# EAGLE design working (EAGLE 6.5.0)
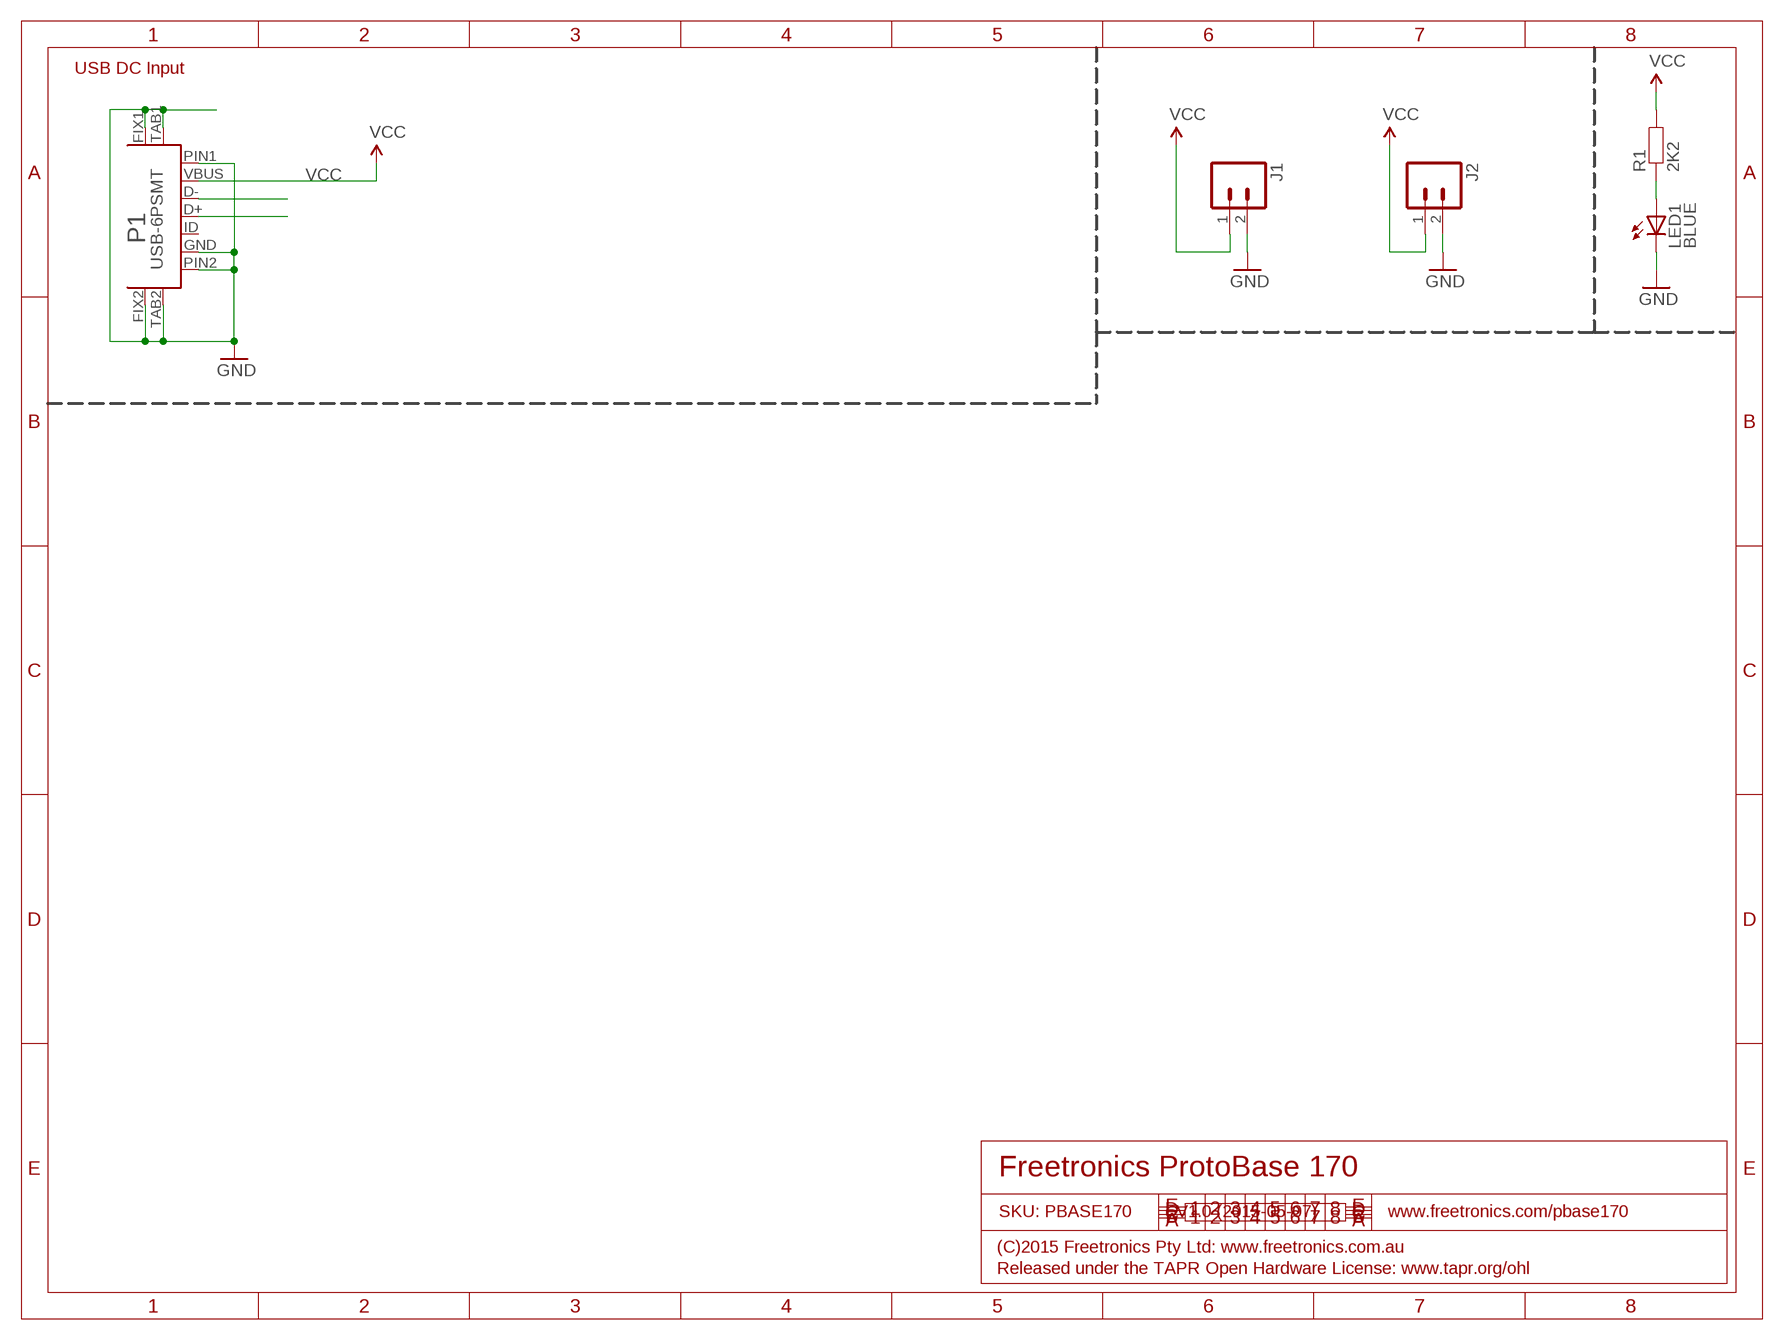
[diagram p0: schematic, sheet 1]

## Parts
J1  M02PTH  [1X02]
J2  M02PTH  [1X02]
LED1  BLUE  LED0603  [LED-0603]
P1  USB-6PSMT  [USB-MICROB-MB05PMXX]
R1  2K2  RESISTOR0603  [0603]

## Nets
GND: J1.2 J2.2 LED1.C P1.FIX1 P1.FIX2 P1.GND P1.PIN1 P1.PIN2 P1.TAB1 P1.TAB2
N$1: LED1.A R1.1
N$16: P1.D+
N$17: P1.D-
VCC: J1.1 J2.1 P1.VBUS R1.2
Unconnected: P1.ID

## Notes on the sheet
- USB DC Input
- Freetronics ProtoBase 170
- SKU: PBASE170 | V1.0 (2015-05-07) | www.freetronics.com/pbase170
- (C)2015 Freetronics Pty Ltd: www.freetronics.com.au
- Released under the TAPR Open Hardware License: www.tapr.org/ohl

## Library data of the parts
J1 J2 = freetronics-original:M02: Header 2 Standard 2-pin 0.1" header. Use with straight break away headers (SKU : PRT-00116), right angle break away headers (PRT-00553), swiss pins (PRT-00743), machine pins (PRT-00117), and female headers (PRT-00115). Molex polarized connector foot print use with SKU : PRT-08233 with associated crimp pins and housings.
LED1 = freetronics-jon:LED: LEDs Standard schematic elements and footprints for 5mm, 3mm, 1206, and 0603 sized LEDs. 5mm - Spark Fun Electronics SKU : COM-00529 (and others)
P1 = freetronics-jon:USB-6P
R1 = freetronics-jon:RESISTOR: Resistor Basic schematic elements and footprints for 0603, 1206, and PTH 1/10th watt (small) resistors.

## Net classes
0 default: width 0.152 mm, drill 0.241 mm, clearance 0.152 mm

## Board
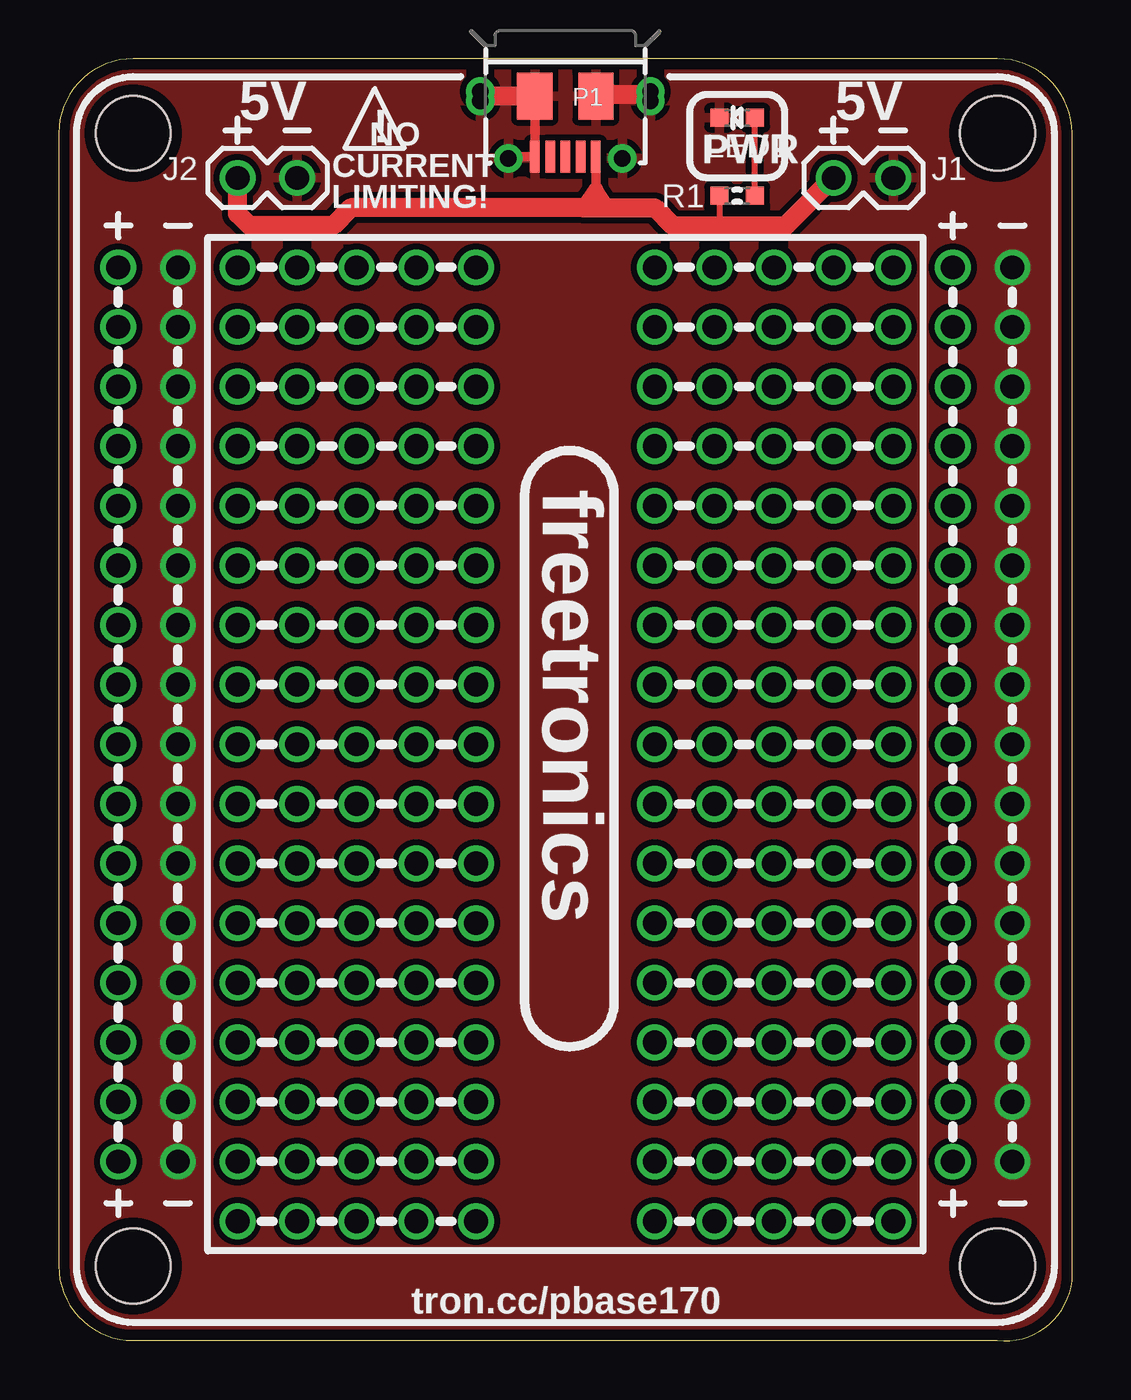
[diagram p1: board, top side]
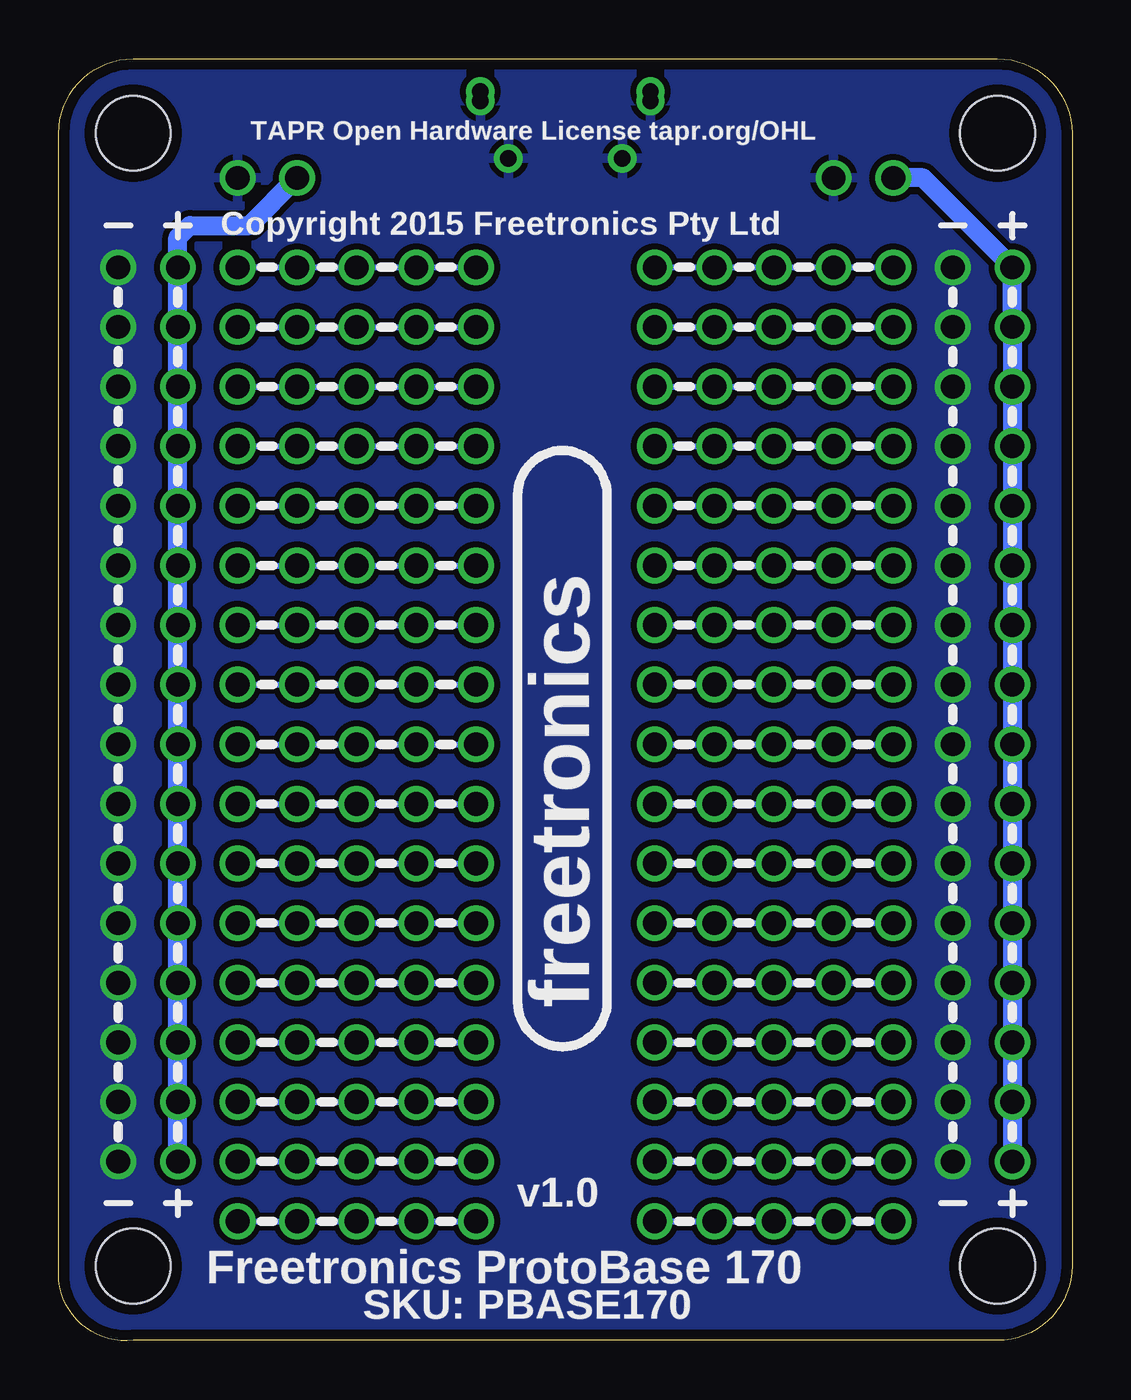
[diagram p2: board, bottom side, seen from below]

Size 43.18 x 54.63 mm. Coordinates in mm from the lower left corner, seen from the top.
Outline: 3.17,54.63 arc90 0,51.45 0,3.19 arc90 3.17,0.02 40.01,0.02 arc90 43.18,2.56 43.18,51.45 arc90 40.01,54.63 3.17,54.63
Copper layers (1*16): Top 0.035mm / dielectric 1.5mm / Bottom 0.035mm
Design rules "default": minimum track width 10mil, minimum drill 18mil, track to track 10mil, track to pad 10mil, pad to pad 10mil, via to via 10mil, smd to smd 8mil, copper to edge 18mil, drill to drill 8mil, minimum pad ring 10mil, minimum via ring 8mil, stop-mask expansion 4mil, vias tented up to drill 25mil, thermal gap 10mil
Holes 3.2 mm at 40.01,51.45 3.17,51.45 3.17,3.19 40.01,3.19

### Footprints (pad centres in the part's own frame; a part is rotated, then mirrored left to right if it is on the bottom)
1X02 = drill 1.016: 1 0,0; 2 2.54,0
LED-0603 = smd 0.762 x 0.762: A -0.762,0; C 0.762,0
USB-MICROB-MB05PMXX = smd 0.4 x 1.35: D+ 0,2.575; D- -0.65,2.575; GND 1.3,2.575; ID 0.65,2.575; VBUS -1.3,2.575 | smd 1.5 x 2: FIX1 -1.3,0; FIX2 1.3,0 | drill 0.7: PIN1 -2.425,2.65; PIN2 2.425,2.65; SLOT1 -3.625,-0.2; SLOT2 3.625,-0.2; TAB1 -3.625,0.2; TAB2 3.625,0.2
0603 = smd 0.762 x 0.762: 1 -0.762,0; 2 0.762,0

### Placement (x,y rotation side)
J1  33.02,49.55 0 top
J2  7.62,49.55 0 top
LED1  28.91,52.11 180 top
P1  21.59,53.03 180 top
R1  28.91,48.79 180 top

### Tracks (layer width: path | path; a pad name or v marks a point on that pad's centre or on a via)
GND  (via drill 1.02)
  Top 0.406: P1.PIN2 19.24,50.45 P1.GND 20.29,53.07 20.32,53.1 18.29,53.1 18.03,52.85
  Top 0.813: P1.FIX2 18.16,53.03 P1.TAB2 | P1.FIX1 23.04,53.03 23.11,53.1 24.94,53.1 P1.TAB1
  other vias: 5.08,45.74 5.08,43.2 5.08,40.66 5.08,30.5 5.08,38.12 5.08,35.58 5.08,33.04 5.08,27.96 5.08,25.42 5.08,22.88 5.08,12.72 5.08,10.18 5.08,7.64 5.08,20.34 5.08,17.8 5.08,15.26 40.64,45.74 40.64,43.2 40.64,40.66 40.64,30.5 40.64,38.12 40.64,35.58 40.64,33.04 40.64,27.96 40.64,25.42 40.64,22.88 40.64,12.72 40.64,10.18 40.64,7.64 40.64,20.34 40.64,17.8 40.64,15.26
  pour Bottom: 40.01,54.63 arc-90 43.18,51.45 43.18,3.19 arc-90 40.01,0.02 3.17,0.02 arc-74 0,3.04 0,51.45 arc-90 3.17,54.63
  pour Top: 40.01,54.63 arc-90 43.18,51.45 43.18,3.19 arc-90 40.01,0.02 3.17,0.02 arc-74 0,3.04 0,51.45 arc-90 3.17,54.63
N$1
  Top 0.254: R1.1 LED1.A
NL1  (via drill 1.02)
  Bottom 0.254: v17.78,10.18 v15.24,10.18 v12.7,10.18 v10.16,10.18 v7.62,10.18
NL2  (via drill 1.02)
  Bottom 0.254: v17.78,12.72 v15.24,12.72 v12.7,12.72 v10.16,12.72 v7.62,12.72
NL3  (via drill 1.02)
  Bottom 0.254: v17.78,15.26 v15.24,15.26 v12.7,15.26 v10.16,15.26 v7.62,15.26
NL4  (via drill 1.02)
  Bottom 0.254: v17.78,17.8 v15.24,17.8 v12.7,17.8 v10.16,17.8 v7.62,17.8
NL5  (via drill 1.02)
  Bottom 0.254: v17.78,20.34 v15.24,20.34 v12.7,20.34 v10.16,20.34 v7.62,20.34
NL6  (via drill 1.02)
  Bottom 0.254: v17.78,22.88 v15.24,22.88 v12.7,22.88 v10.16,22.88 v7.62,22.88
NL7  (via drill 1.02)
  Bottom 0.254: v17.78,25.42 v15.24,25.42 v12.7,25.42 v10.16,25.42 v7.62,25.42
NL8  (via drill 1.02)
  Bottom 0.254: v17.78,27.96 v15.24,27.96 v12.7,27.96 v10.16,27.96 v7.62,27.96
NL9  (via drill 1.02)
  Bottom 0.254: v17.78,30.5 v15.24,30.5 v12.7,30.5 v10.16,30.5 v7.62,30.5
NL10  (via drill 1.02)
  Bottom 0.254: v17.78,33.04 v15.24,33.04 v12.7,33.04 v10.16,33.04 v7.62,33.04
NL11  (via drill 1.02)
  Bottom 0.254: v17.78,35.58 v15.24,35.58 v12.7,35.58 v10.16,35.58 v7.62,35.58
NL12  (via drill 1.02)
  Bottom 0.254: v17.78,38.12 v15.24,38.12 v12.7,38.12 v10.16,38.12 v7.62,38.12
NL13  (via drill 1.02)
  Bottom 0.254: v17.78,40.66 v15.24,40.66 v12.7,40.66 v10.16,40.66 v7.62,40.66
NL14  (via drill 1.02)
  Bottom 0.254: v17.78,7.64 v15.24,7.64 v12.7,7.64 v10.16,7.64 v7.62,7.64
NL15  (via drill 1.02)
  Bottom 0.254: v17.78,43.2 v15.24,43.2 v12.7,43.2 v10.16,43.2 v7.62,43.2
NL16  (via drill 1.02)
  Bottom 0.254: v17.78,45.74 v15.24,45.74 v12.7,45.74 v10.16,45.74 v7.62,45.74
NL17  (via drill 1.02)
  Bottom 0.254: v17.78,5.1 v15.24,5.1 v12.7,5.1 v10.16,5.1 v7.62,5.1
NR1  (via drill 1.02)
  Bottom 0.254: v35.56,10.18 v33.02,10.18 v30.48,10.18 v27.94,10.18 v25.4,10.18
NR2  (via drill 1.02)
  Bottom 0.254: v35.56,12.72 v33.02,12.72 v30.48,12.72 v27.94,12.72 v25.4,12.72
NR3  (via drill 1.02)
  Bottom 0.254: v35.56,15.26 v33.02,15.26 v30.48,15.26 v27.94,15.26 v25.4,15.26
NR4  (via drill 1.02)
  Bottom 0.254: v35.56,17.8 v33.02,17.8 v30.48,17.8 v27.94,17.8 v25.4,17.8
NR5  (via drill 1.02)
  Bottom 0.254: v35.56,20.34 v33.02,20.34 v30.48,20.34 v27.94,20.34 v25.4,20.34
NR6  (via drill 1.02)
  Bottom 0.254: v35.56,22.88 v33.02,22.88 v30.48,22.88 v27.94,22.88 v25.4,22.88
NR7  (via drill 1.02)
  Bottom 0.254: v35.56,25.42 v33.02,25.42 v30.48,25.42 v27.94,25.42 v25.4,25.42
NR8  (via drill 1.02)
  Bottom 0.254: v35.56,27.96 v33.02,27.96 v30.48,27.96 v27.94,27.96 v25.4,27.96
NR9  (via drill 1.02)
  Bottom 0.254: v35.56,30.5 v33.02,30.5 v30.48,30.5 v27.94,30.5 v25.4,30.5
NR10  (via drill 1.02)
  Bottom 0.254: v35.56,33.04 v33.02,33.04 v30.48,33.04 v27.94,33.04 v25.4,33.04
NR11  (via drill 1.02)
  Bottom 0.254: v35.56,35.58 v33.02,35.58 v30.48,35.58 v27.94,35.58 v25.4,35.58
NR12  (via drill 1.02)
  Bottom 0.254: v35.56,38.12 v33.02,38.12 v30.48,38.12 v27.94,38.12 v25.4,38.12
NR13  (via drill 1.02)
  Bottom 0.254: v35.56,40.66 v33.02,40.66 v30.48,40.66 v27.94,40.66 v25.4,40.66
NR14  (via drill 1.02)
  Bottom 0.254: v35.56,7.64 v33.02,7.64 v30.48,7.64 v27.94,7.64 v25.4,7.64
NR15  (via drill 1.02)
  Bottom 0.254: v35.56,43.2 v33.02,43.2 v30.48,43.2 v27.94,43.2 v25.4,43.2
NR16  (via drill 1.02)
  Bottom 0.254: v35.56,45.74 v33.02,45.74 v30.48,45.74 v27.94,45.74 v25.4,45.74
NR17  (via drill 1.02)
  Bottom 0.254: v35.56,5.1 v33.02,5.1 v30.48,5.1 v27.94,5.1 v25.4,5.1
VCC  (via drill 1.02)
  Top 0.254: R1.2 28.15,47.56 28.19,47.52
  Top 0.406: P1.VBUS 22.89,49.07
  Top 0.61: 22.35,48.28 22.89,49.07 22.89,49.01 23.37,48.28
  Top 0.813: J2.1 7.62,48.02 8.13,47.52 11.68,47.52 12.45,48.28 22.35,48.28 23.37,48.28 25.4,48.28 26.16,47.52 28.19,47.52 30.99,47.52 J1.1
  Bottom 0.813: v2.54,7.64 v2.54,10.18 v2.54,12.72 v2.54,15.26 v2.54,17.8 v2.54,20.34 v2.54,22.88 v2.54,25.42 v2.54,27.96 v2.54,30.5 v2.54,33.04 v2.54,35.58 v2.54,38.12 v2.54,40.66 v2.54,43.2 v2.54,45.74 6.35,49.55 J2.1 | v38.1,7.64 v38.1,10.18 v38.1,12.72 v38.1,15.26 v38.1,17.8 v38.1,20.34 v38.1,22.88 v38.1,25.42 v38.1,27.96 v38.1,30.5 v38.1,33.04 v38.1,35.58 v38.1,38.12 v38.1,40.66 v38.1,43.2 v38.1,45.74 38.1,47.01 37.59,47.52 35.05,47.52 J1.1

### Text on the board
tPlace: 5V | 5V | ! | PWR | NO / CURRENT / LIMITING! | freetronics | tron.cc/pbase170
bPlace: TAPR Open Hardware License tapr.org/OHL | Copyright 2015 Freetronics Pty Ltd | freetronics | v1.0 | Freetronics ProtoBase 170 | SKU: PBASE170